# EAGLE board 15R (EAGLE 9.6.0), part 1 of 2
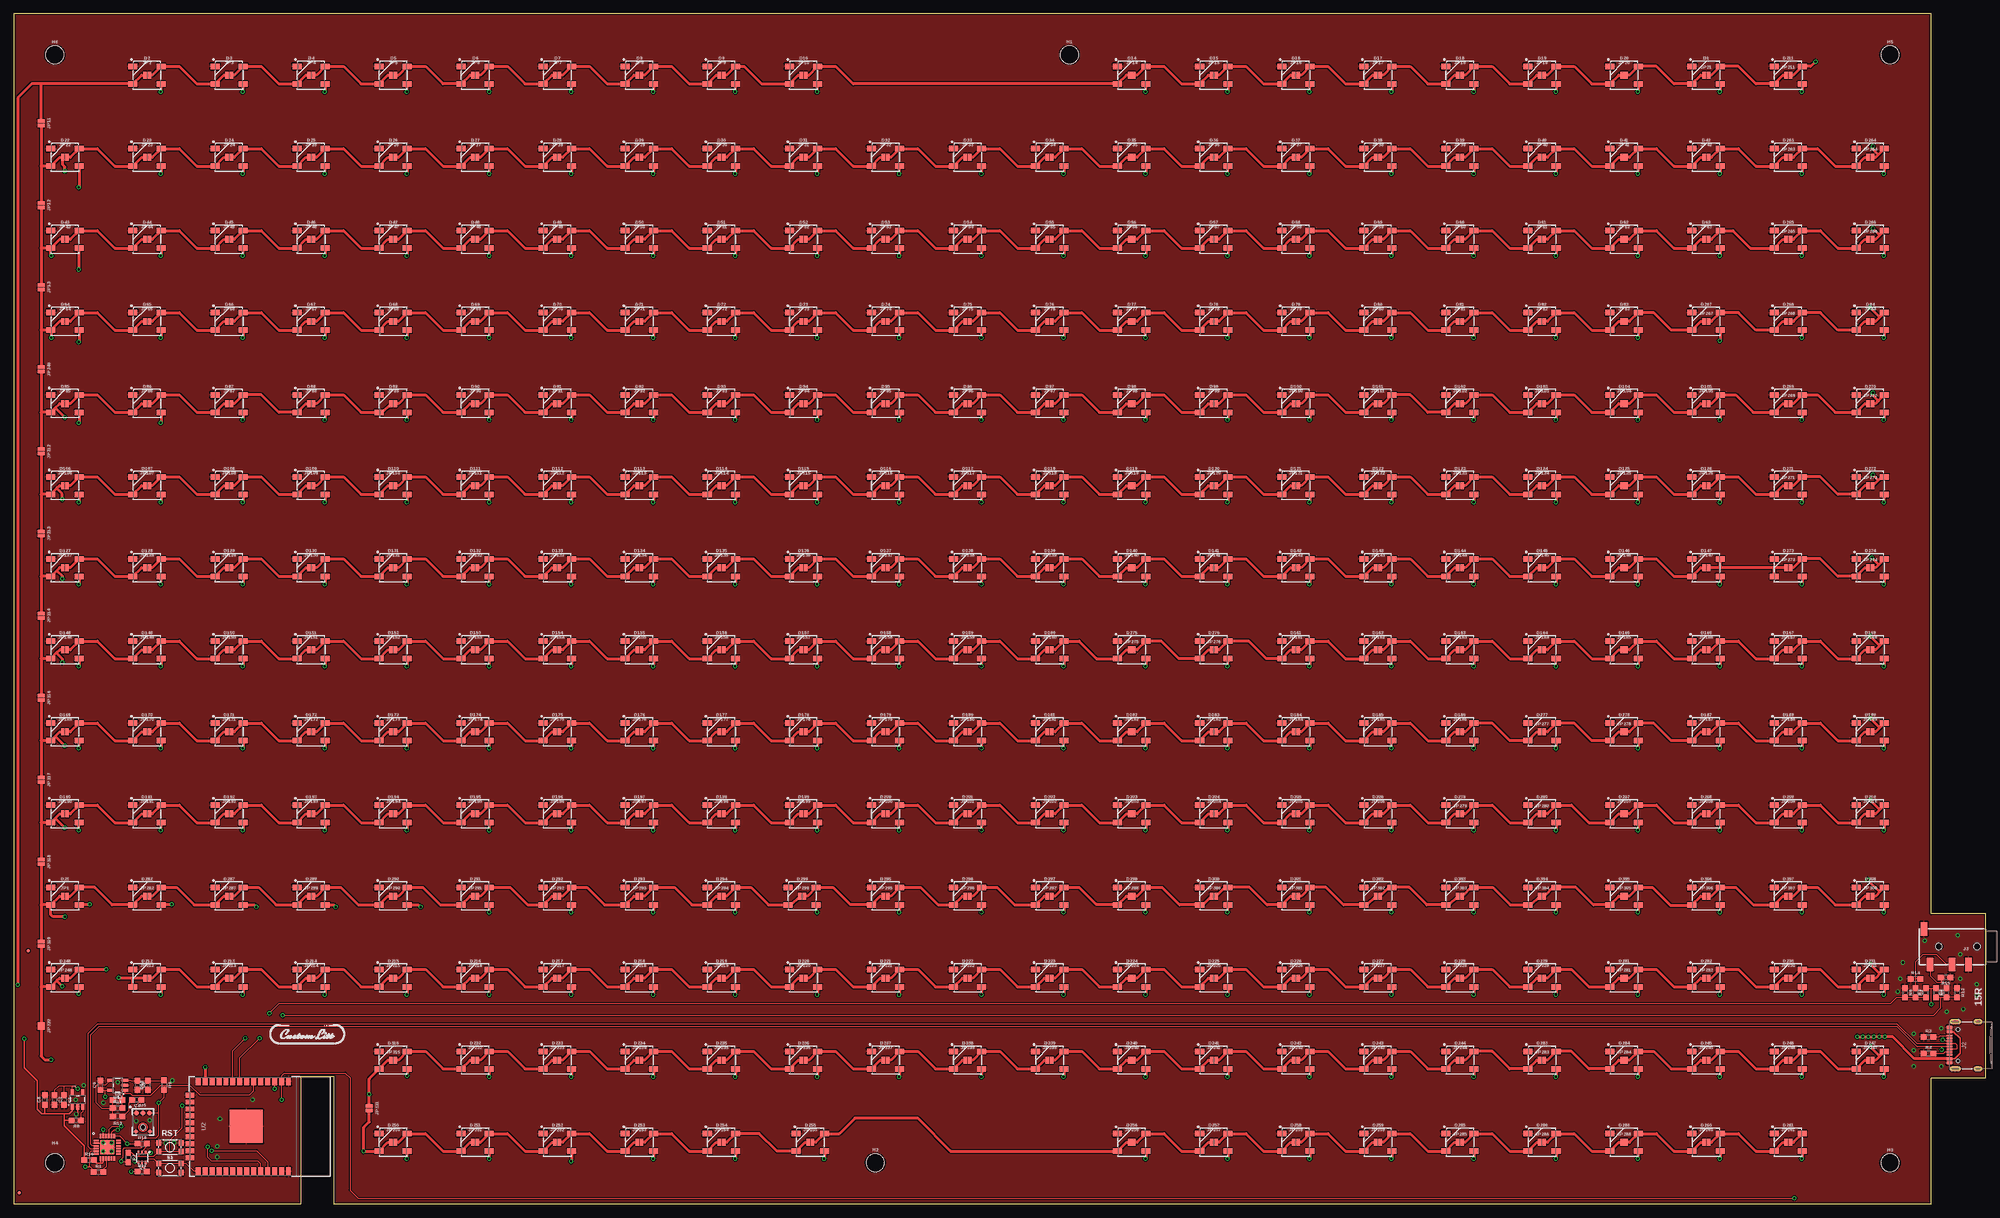
[diagram p7: board, top side]
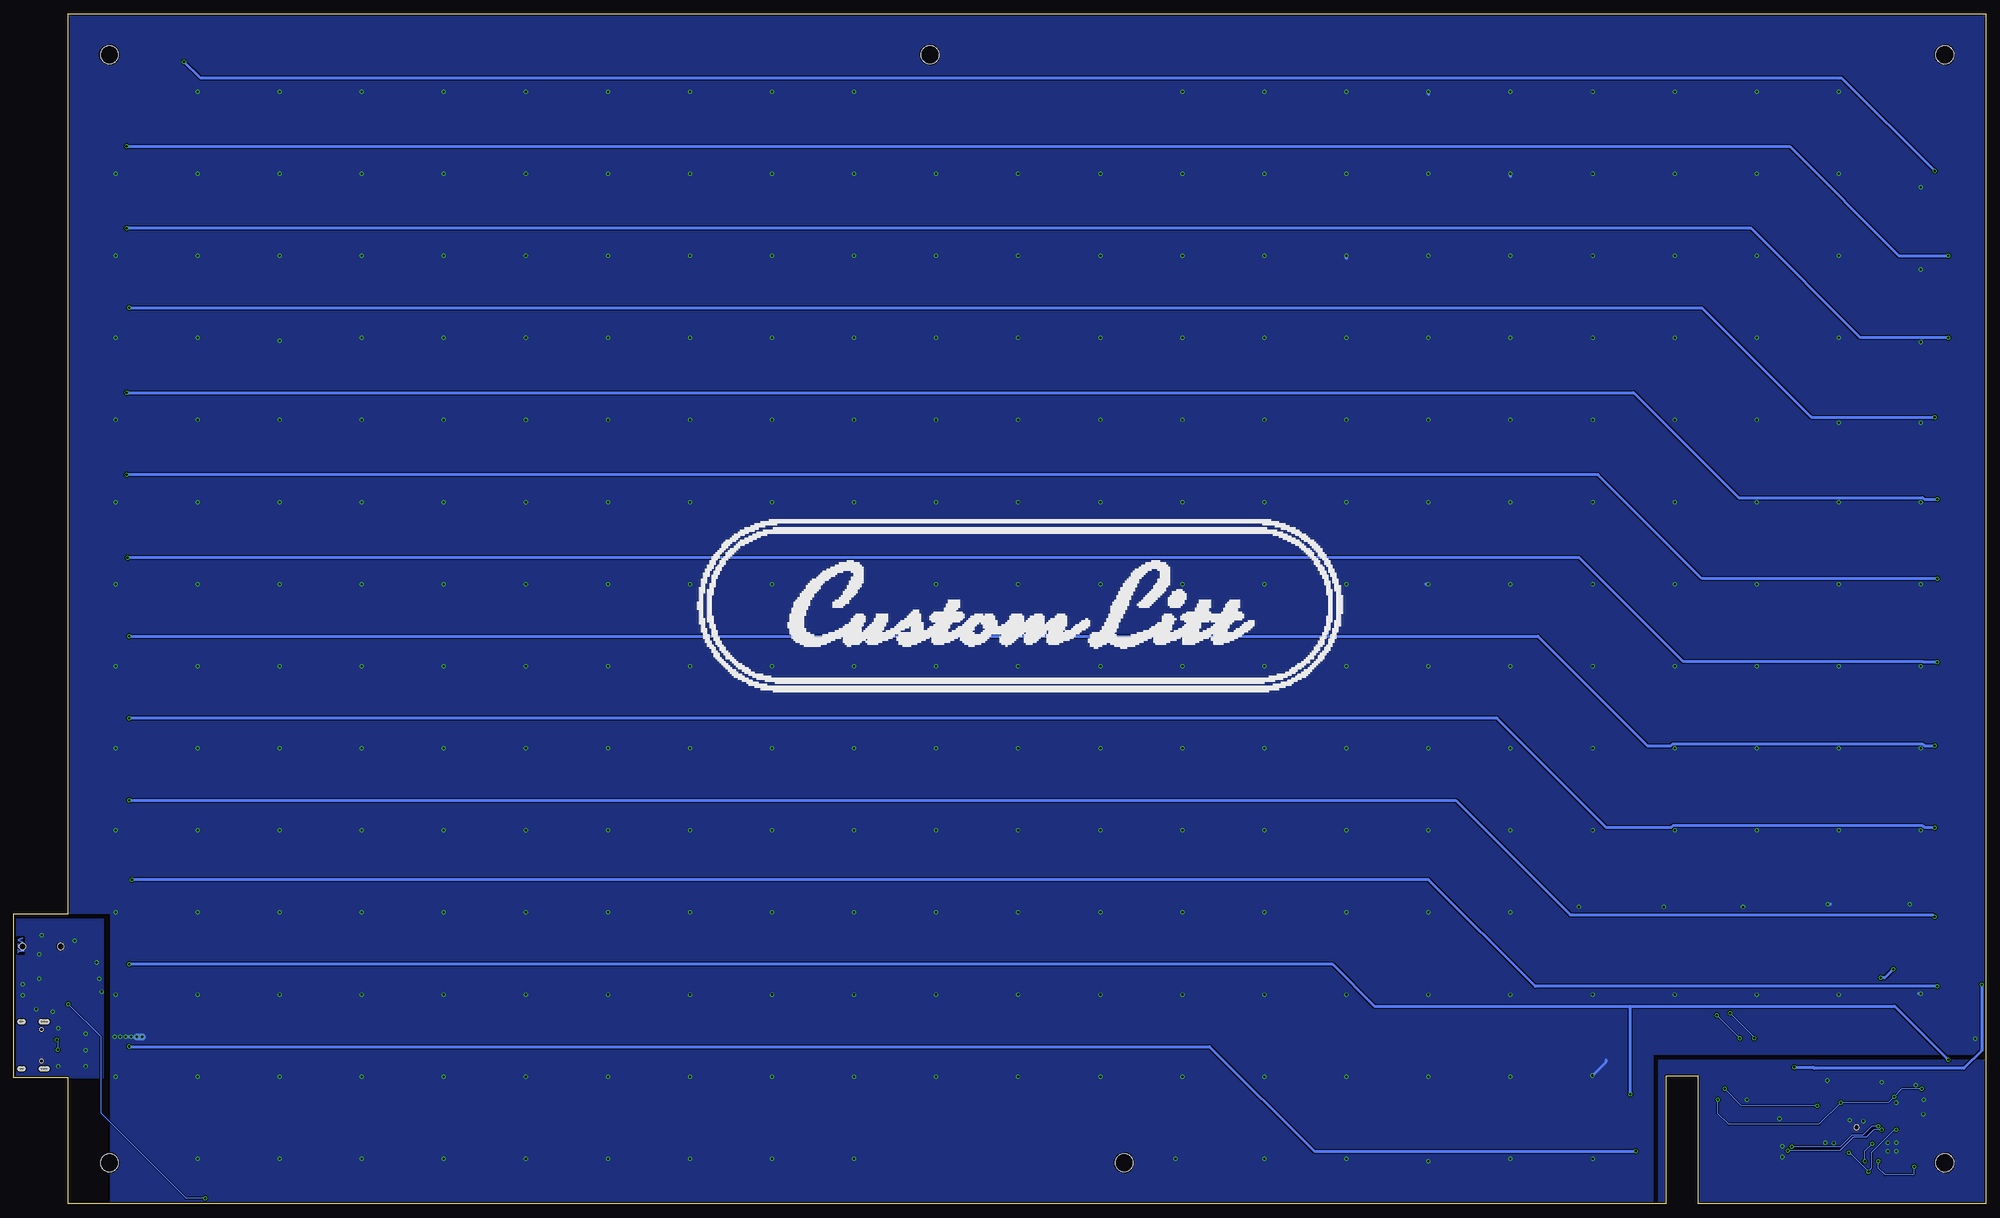
[diagram p8: board, bottom side, seen from below]

Size 360.5 x 217.5 mm. Coordinates in mm from the lower left corner, seen from the top.
Outline: 350.5,0 350.5,23 360.5,23 360.5,53 350.5,53 350.5,217.5 0,217.5 0,0 52.56,0 52.56,23.32 58.53,23.32 58.53,0 350.5,0
Copper layers (1*16): Top 0.035mm / dielectric 1.5mm / Bottom 0.035mm
Design rules "SparkFun-2-layer-TIGHT *": minimum track width 7mil, minimum drill 15mil, track to track 7mil, track to pad 7mil, pad to pad 7mil, via to via 7mil, smd to smd 7mil, copper to edge 7mil, drill to drill 7mil, minimum pad ring 7mil, minimum via ring 7mil, stop-mask expansion 4mil, vias tented up to drill 25mil, thermal gap 10mil

## Footprints (pad centres in the part's own frame; a part is rotated, then mirrored left to right if it is on the bottom)
0603 = smd 1.1 x 1: 1 -0.85,0; 2 0.85,0
WS2812B = smd 1.651 x 1: 1 2.577,-1.6; 2 2.577,1.6; 3 -2.577,1.6; 4 -2.577,-1.6
FIDUCIAL-MICRO = smd 0.635 x 0.635: 1 0,0
STAND-OFF = hole 3.302: 0,0
USB-C-16P = smd 0.3 x 1.016: A5 -1.25,0.154; A6 -0.25,0.154; A7 0.25,0.154; A8 1.25,0.154; B5 1.75,0.154; B6 0.75,0.154; B7 -0.75,0.154; B8 -1.75,0.154 | smd 0.6 x 1.016: GND -3.225,0.154; GND2 3.225,0.154 | smd 1 x 2.1: SHLD1 -4.32,-0.915; SHLD2 4.32,-0.915 | smd 1 x 2.1 bottom: SHLD3 -4.32,-0.915; SHLD4 4.32,-0.915 | smd 1 x 1.6: SHLD5 -4.32,-5.095; SHLD8 4.32,-5.095 | smd 1 x 1.6 bottom: SHLD6 -4.32,-5.095; SHLD7 4.32,-5.095 | smd 0.55 x 1.016: VBUS1 -2.45,0.154; VBUS2 2.45,0.154 | hole 0.65: -2.89,-1.445; 2.89,-1.445
AUDIO_JACK_3.5MM_TRRS_SMD_RA = smd 1.2 x 2.5: EARTH 11.3,-3.25; RING1 6.2,3.25; RING2 3.2,3.25; TIP 10.2,3.25 | hole 1.2: 1.6,0; 8.6,0
SMT-JUMPER_2_NO_NO-SILK = smd 0.635 x 1.27: 1 -0.406,0; 2 0.406,0
SC70-6 = smd 0.3 x 0.66: 1 -0.65,-0.92; 2 0,-0.92; 3 0.65,-0.92; 4 0.65,0.92; 5 0,0.92; 6 -0.65,0.92
TACTILE_SWITCH_SMD_4.6X2.8MM = smd 0.9 x 1: 1 -2.05,-0.8; 2 2.05,-0.8; 3 2.05,0.8; 4 -2.05,0.8
ESP-WROOM-32-NARROW = smd 0.9 x 1.5: 1 6.43,8.238; 2 5.16,8.238; 3 3.89,8.238; 4 2.62,8.238; 5 1.35,8.238; 6 0.08,8.238; 7 -1.19,8.238; 8 -2.46,8.238; 9 -3.73,8.238; 10 -5,8.238; 11 -6.27,8.238; 12 -7.54,8.238; 13 -8.81,8.238; 14 -10.08,8.238; 25 -10.08,-8.238; 26 -8.81,-8.238; 27 -7.54,-8.238; 28 -6.27,-8.238; 29 -5,-8.238; 30 -3.73,-8.238; 31 -2.46,-8.238; 32 -1.19,-8.238; 33 0.08,-8.238; 34 1.35,-8.238; 35 2.62,-8.238; 36 3.89,-8.238; 37 5.16,-8.238; 38 6.43,-8.238 | smd 1.5 x 0.9: 15 -11.57,5.715; 16 -11.57,4.445; 17 -11.57,3.175; 18 -11.57,1.905; 19 -11.57,0.635; 20 -11.57,-0.635; 21 -11.57,-1.905; 22 -11.57,-3.175; 23 -11.57,-4.445; 24 -11.57,-5.715 | smd 6 x 6: GND -1.27,0
SOT23-5 = smd 0.55 x 1.2: 1 -0.95,-1.3; 2 0,-1.3; 3 0.95,-1.3; 4 0.95,1.3; 5 -0.95,1.3
QFN24 = smd 0.85 x 0.3: 1 -2.05,1.25; 2 -2.05,0.75; 3 -2.05,0.25; 4 -2.05,-0.25; 5 -2.05,-0.75; 6 -2.05,-1.25; 13 2.05,-1.25; 14 2.05,-0.75; 15 2.05,-0.25; 16 2.05,0.25; 17 2.05,0.75; 18 2.05,1.25 | smd 0.3 x 0.85: 7 -1.25,-2.05; 8 -0.75,-2.05; 9 -0.25,-2.05; 10 0.25,-2.05; 11 0.75,-2.05; 12 1.25,-2.05; 19 1.25,2.05; 20 0.75,2.05; 21 0.25,2.05; 22 -0.25,2.05; 23 -0.75,2.05; 24 -1.25,2.05 | smd 2.55 x 2.55: PAD 0,0
ADMP401 = smd 0.9 x 0.9: 1 -1.2,2.62; 5 1.2,2.62; 6 0,2.62 | smd 0.7 x 0.7: 2 1.3,-0.8; 4 -1.3,-0.8 | hole 0.9: 0,0

## Placement (x,y rotation side)
C1  10uF  [0603]  9.2,19 270 top
C2  0.1uF  [0603]  347.62,38.59 270 top
C3  0.1uF  [0603]  353.34,38.59 90 top
C4  4.7uF  [0603]  22.5,19 180 top
C5  100pF  [0603]  19,19 0 top
C6  1.0uF  [0603]  22.61,21.67 270 top
C7  1.0uF  [0603]  7.45,19 270 top
C8  1.0uF  [0603]  5.7,19 90 top
C9  0.1uF  [0603]  15.86,21.67 90 top
D1  WS2812B  [WS2812B]  309.38,206.25 0 top
D2  WS2812B  [WS2812B]  24.38,206.25 0 top
D3  WS2812B  [WS2812B]  39.38,206.25 0 top
D4  WS2812B  [WS2812B]  54.38,206.25 0 top
D5  WS2812B  [WS2812B]  69.38,206.25 0 top
D6  WS2812B  [WS2812B]  84.38,206.25 0 top
D7  WS2812B  [WS2812B]  99.38,206.25 0 top
D8  WS2812B  [WS2812B]  114.38,206.25 0 top
D9  WS2812B  [WS2812B]  129.38,206.25 0 top
D10  WS2812B  [WS2812B]  144.38,206.25 0 top
D14  WS2812B  [WS2812B]  204.38,206.25 0 top
D15  WS2812B  [WS2812B]  219.38,206.25 0 top
D16  WS2812B  [WS2812B]  234.38,206.25 0 top
D17  WS2812B  [WS2812B]  249.38,206.25 0 top
D18  WS2812B  [WS2812B]  264.38,206.25 0 top
D19  WS2812B  [WS2812B]  279.38,206.25 0 top
D20  WS2812B  [WS2812B]  294.38,206.25 0 top
D21  WS2812B  [WS2812B]  9.38,56.25 0 top
D22  WS2812B  [WS2812B]  9.38,191.25 0 top
D23  WS2812B  [WS2812B]  24.38,191.25 0 top
D24  WS2812B  [WS2812B]  39.38,191.25 0 top
D25  WS2812B  [WS2812B]  54.38,191.25 0 top
D26  WS2812B  [WS2812B]  69.38,191.25 0 top
D27  WS2812B  [WS2812B]  84.38,191.25 0 top
D28  WS2812B  [WS2812B]  99.38,191.25 0 top
D29  WS2812B  [WS2812B]  114.38,191.25 0 top
D30  WS2812B  [WS2812B]  129.38,191.25 0 top
D31  WS2812B  [WS2812B]  144.38,191.25 0 top
D32  WS2812B  [WS2812B]  159.38,191.25 0 top
D33  WS2812B  [WS2812B]  174.38,191.25 0 top
D34  WS2812B  [WS2812B]  189.38,191.25 0 top
D35  WS2812B  [WS2812B]  204.38,191.25 0 top
D36  WS2812B  [WS2812B]  219.38,191.25 0 top
D37  WS2812B  [WS2812B]  234.38,191.25 0 top
D38  WS2812B  [WS2812B]  249.38,191.25 0 top
D39  WS2812B  [WS2812B]  264.38,191.25 0 top
D40  WS2812B  [WS2812B]  279.38,191.25 0 top
D41  WS2812B  [WS2812B]  294.38,191.25 0 top
D42  WS2812B  [WS2812B]  309.38,191.25 0 top
D43  WS2812B  [WS2812B]  9.38,176.25 0 top
D44  WS2812B  [WS2812B]  24.38,176.25 0 top
D45  WS2812B  [WS2812B]  39.38,176.25 0 top
D46  WS2812B  [WS2812B]  54.38,176.25 0 top
D47  WS2812B  [WS2812B]  69.38,176.25 0 top
D48  WS2812B  [WS2812B]  84.38,176.25 0 top
D49  WS2812B  [WS2812B]  99.38,176.25 0 top
D50  WS2812B  [WS2812B]  114.38,176.25 0 top
D51  WS2812B  [WS2812B]  129.38,176.25 0 top
D52  WS2812B  [WS2812B]  144.38,176.25 0 top
D53  WS2812B  [WS2812B]  159.38,176.25 0 top
D54  WS2812B  [WS2812B]  174.38,176.25 0 top
D55  WS2812B  [WS2812B]  189.38,176.25 0 top
D56  WS2812B  [WS2812B]  204.38,176.25 0 top
D57  WS2812B  [WS2812B]  219.38,176.25 0 top
D58  WS2812B  [WS2812B]  234.38,176.25 0 top
D59  WS2812B  [WS2812B]  249.38,176.25 0 top
D60  WS2812B  [WS2812B]  264.38,176.25 0 top
D61  WS2812B  [WS2812B]  279.38,176.25 0 top
D62  WS2812B  [WS2812B]  294.38,176.25 0 top
D63  WS2812B  [WS2812B]  309.38,176.25 0 top
D64  WS2812B  [WS2812B]  9.38,161.25 0 top
D65  WS2812B  [WS2812B]  24.38,161.25 0 top
D66  WS2812B  [WS2812B]  39.38,161.25 0 top
D67  WS2812B  [WS2812B]  54.38,161.25 0 top
D68  WS2812B  [WS2812B]  69.38,161.25 0 top
D69  WS2812B  [WS2812B]  84.38,161.25 0 top
D70  WS2812B  [WS2812B]  99.38,161.25 0 top
D71  WS2812B  [WS2812B]  114.38,161.25 0 top
D72  WS2812B  [WS2812B]  129.38,161.25 0 top
D73  WS2812B  [WS2812B]  144.38,161.25 0 top
D74  WS2812B  [WS2812B]  159.38,161.25 0 top
D75  WS2812B  [WS2812B]  174.38,161.25 0 top
D76  WS2812B  [WS2812B]  189.38,161.25 0 top
D77  WS2812B  [WS2812B]  204.38,161.25 0 top
D78  WS2812B  [WS2812B]  219.38,161.25 0 top
D79  WS2812B  [WS2812B]  234.38,161.25 0 top
D80  WS2812B  [WS2812B]  249.38,161.25 0 top
D81  WS2812B  [WS2812B]  264.38,161.25 0 top
D82  WS2812B  [WS2812B]  279.38,161.25 0 top
D83  WS2812B  [WS2812B]  294.38,161.25 0 top
D84  WS2812B  [WS2812B]  339.38,161.25 0 top
D85  WS2812B  [WS2812B]  9.38,146.25 0 top
D86  WS2812B  [WS2812B]  24.38,146.25 0 top
D87  WS2812B  [WS2812B]  39.38,146.25 0 top
D88  WS2812B  [WS2812B]  54.38,146.25 0 top
D89  WS2812B  [WS2812B]  69.38,146.25 0 top
D90  WS2812B  [WS2812B]  84.38,146.25 0 top
D91  WS2812B  [WS2812B]  99.38,146.25 0 top
D92  WS2812B  [WS2812B]  114.38,146.25 0 top
D93  WS2812B  [WS2812B]  129.38,146.25 0 top
D94  WS2812B  [WS2812B]  144.38,146.25 0 top
D95  WS2812B  [WS2812B]  159.38,146.25 0 top
D96  WS2812B  [WS2812B]  174.38,146.25 0 top
D97  WS2812B  [WS2812B]  189.38,146.25 0 top
D98  WS2812B  [WS2812B]  204.38,146.25 0 top
D99  WS2812B  [WS2812B]  219.38,146.25 0 top
D100  WS2812B  [WS2812B]  234.38,146.25 0 top
D101  WS2812B  [WS2812B]  249.38,146.25 0 top
D102  WS2812B  [WS2812B]  264.38,146.25 0 top
D103  WS2812B  [WS2812B]  279.38,146.25 0 top
D104  WS2812B  [WS2812B]  294.38,146.25 0 top
D105  WS2812B  [WS2812B]  309.38,146.25 0 top
D106  WS2812B  [WS2812B]  9.38,131.25 0 top
D107  WS2812B  [WS2812B]  24.38,131.25 0 top
D108  WS2812B  [WS2812B]  39.38,131.25 0 top
D109  WS2812B  [WS2812B]  54.38,131.25 0 top
D110  WS2812B  [WS2812B]  69.38,131.25 0 top
D111  WS2812B  [WS2812B]  84.38,131.25 0 top
D112  WS2812B  [WS2812B]  99.38,131.25 0 top
D113  WS2812B  [WS2812B]  114.38,131.25 0 top
D114  WS2812B  [WS2812B]  129.38,131.25 0 top
D115  WS2812B  [WS2812B]  144.38,131.25 0 top
D116  WS2812B  [WS2812B]  159.38,131.25 0 top
D117  WS2812B  [WS2812B]  174.38,131.25 0 top
D118  WS2812B  [WS2812B]  189.38,131.25 0 top
D119  WS2812B  [WS2812B]  204.38,131.25 0 top
D120  WS2812B  [WS2812B]  219.38,131.25 0 top
D121  WS2812B  [WS2812B]  234.38,131.25 0 top
D122  WS2812B  [WS2812B]  249.38,131.25 0 top
D123  WS2812B  [WS2812B]  264.38,131.25 0 top
D124  WS2812B  [WS2812B]  279.38,131.25 0 top
D125  WS2812B  [WS2812B]  294.38,131.25 0 top
D126  WS2812B  [WS2812B]  309.38,131.25 0 top
D127  WS2812B  [WS2812B]  9.38,116.25 0 top
D128  WS2812B  [WS2812B]  24.38,116.25 0 top
D129  WS2812B  [WS2812B]  39.38,116.25 0 top
D130  WS2812B  [WS2812B]  54.38,116.25 0 top
D131  WS2812B  [WS2812B]  69.38,116.25 0 top
D132  WS2812B  [WS2812B]  84.38,116.25 0 top
D133  WS2812B  [WS2812B]  99.38,116.25 0 top
D134  WS2812B  [WS2812B]  114.38,116.25 0 top
D135  WS2812B  [WS2812B]  129.38,116.25 0 top
D136  WS2812B  [WS2812B]  144.38,116.25 0 top
D137  WS2812B  [WS2812B]  159.38,116.25 0 top
D138  WS2812B  [WS2812B]  174.38,116.25 0 top
D139  WS2812B  [WS2812B]  189.38,116.25 0 top
D140  WS2812B  [WS2812B]  204.38,116.25 0 top
D141  WS2812B  [WS2812B]  219.38,116.25 0 top
D142  WS2812B  [WS2812B]  234.38,116.25 0 top
D143  WS2812B  [WS2812B]  249.38,116.25 0 top
D144  WS2812B  [WS2812B]  264.38,116.25 0 top
D145  WS2812B  [WS2812B]  279.38,116.25 0 top
D146  WS2812B  [WS2812B]  294.38,116.25 0 top
D147  WS2812B  [WS2812B]  309.38,116.25 0 top
D148  WS2812B  [WS2812B]  9.38,101.25 0 top
D149  WS2812B  [WS2812B]  24.38,101.25 0 top
D150  WS2812B  [WS2812B]  39.38,101.25 0 top
D151  WS2812B  [WS2812B]  54.38,101.25 0 top
D152  WS2812B  [WS2812B]  69.38,101.25 0 top
D153  WS2812B  [WS2812B]  84.38,101.25 0 top
D154  WS2812B  [WS2812B]  99.38,101.25 0 top
D155  WS2812B  [WS2812B]  114.38,101.25 0 top
D156  WS2812B  [WS2812B]  129.38,101.25 0 top
D157  WS2812B  [WS2812B]  144.38,101.25 0 top
D158  WS2812B  [WS2812B]  159.38,101.25 0 top
D159  WS2812B  [WS2812B]  174.38,101.25 0 top
D160  WS2812B  [WS2812B]  189.38,101.25 0 top
D161  WS2812B  [WS2812B]  234.38,101.25 0 top
D162  WS2812B  [WS2812B]  249.38,101.25 0 top
D163  WS2812B  [WS2812B]  264.38,101.25 0 top
D164  WS2812B  [WS2812B]  279.38,101.25 0 top
D165  WS2812B  [WS2812B]  294.38,101.25 0 top
D166  WS2812B  [WS2812B]  309.38,101.25 0 top
D167  WS2812B  [WS2812B]  324.38,101.25 0 top
D168  WS2812B  [WS2812B]  339.38,101.25 0 top
D169  WS2812B  [WS2812B]  9.38,86.25 0 top
D170  WS2812B  [WS2812B]  24.38,86.25 0 top
D171  WS2812B  [WS2812B]  39.38,86.25 0 top
D172  WS2812B  [WS2812B]  54.38,86.25 0 top
D173  WS2812B  [WS2812B]  69.38,86.25 0 top
D174  WS2812B  [WS2812B]  84.38,86.25 0 top
D175  WS2812B  [WS2812B]  99.38,86.25 0 top
D176  WS2812B  [WS2812B]  114.38,86.25 0 top
D177  WS2812B  [WS2812B]  129.38,86.25 0 top
D178  WS2812B  [WS2812B]  144.38,86.25 0 top
D179  WS2812B  [WS2812B]  159.38,86.25 0 top
D180  WS2812B  [WS2812B]  174.38,86.25 0 top
D181  WS2812B  [WS2812B]  189.38,86.25 0 top
D182  WS2812B  [WS2812B]  204.38,86.25 0 top
D183  WS2812B  [WS2812B]  219.38,86.25 0 top
D184  WS2812B  [WS2812B]  234.38,86.25 0 top
D185  WS2812B  [WS2812B]  249.38,86.25 0 top
D186  WS2812B  [WS2812B]  264.38,86.25 0 top
D187  WS2812B  [WS2812B]  309.38,86.25 0 top
D188  WS2812B  [WS2812B]  324.38,86.25 0 top
D189  WS2812B  [WS2812B]  339.38,86.25 0 top
D190  WS2812B  [WS2812B]  9.38,71.25 0 top
D191  WS2812B  [WS2812B]  24.38,71.25 0 top
D192  WS2812B  [WS2812B]  39.38,71.25 0 top
D193  WS2812B  [WS2812B]  54.38,71.25 0 top
D194  WS2812B  [WS2812B]  69.38,71.25 0 top
D195  WS2812B  [WS2812B]  84.38,71.25 0 top
D196  WS2812B  [WS2812B]  99.38,71.25 0 top
D197  WS2812B  [WS2812B]  114.38,71.25 0 top
D198  WS2812B  [WS2812B]  129.38,71.25 0 top
D199  WS2812B  [WS2812B]  144.38,71.25 0 top
D200  WS2812B  [WS2812B]  159.38,71.25 0 top
D201  WS2812B  [WS2812B]  174.38,71.25 0 top
D202  WS2812B  [WS2812B]  189.38,71.25 0 top
D203  WS2812B  [WS2812B]  204.38,71.25 0 top
D204  WS2812B  [WS2812B]  219.38,71.25 0 top
D205  WS2812B  [WS2812B]  234.38,71.25 0 top
D206  WS2812B  [WS2812B]  249.38,71.25 0 top
D207  WS2812B  [WS2812B]  294.38,71.25 0 top
D208  WS2812B  [WS2812B]  309.38,71.25 0 top
D209  WS2812B  [WS2812B]  324.38,71.25 0 top
D210  WS2812B  [WS2812B]  339.38,71.25 0 top
D211  WS2812B  [WS2812B]  324.38,206.25 0 top
D212  WS2812B  [WS2812B]  24.38,41.25 0 top
D213  WS2812B  [WS2812B]  39.38,41.25 0 top
D214  WS2812B  [WS2812B]  54.38,41.25 0 top
D215  WS2812B  [WS2812B]  69.38,41.25 0 top
D216  WS2812B  [WS2812B]  84.38,41.25 0 top
D217  WS2812B  [WS2812B]  99.38,41.25 0 top
D218  WS2812B  [WS2812B]  114.38,41.25 0 top
D219  WS2812B  [WS2812B]  129.38,41.25 0 top
D220  WS2812B  [WS2812B]  144.38,41.25 0 top
D221  WS2812B  [WS2812B]  159.38,41.25 0 top
D222  WS2812B  [WS2812B]  174.38,41.25 0 top
D223  WS2812B  [WS2812B]  189.38,41.25 0 top
D224  WS2812B  [WS2812B]  204.38,41.25 0 top
D225  WS2812B  [WS2812B]  219.38,41.25 0 top
D226  WS2812B  [WS2812B]  234.38,41.25 0 top
D227  WS2812B  [WS2812B]  249.38,41.25 0 top
D228  WS2812B  [WS2812B]  264.38,41.25 0 top
D229  WS2812B  [WS2812B]  279.38,41.25 0 top
D230  WS2812B  [WS2812B]  324.38,41.25 0 top
D231  WS2812B  [WS2812B]  339.38,41.25 0 top
D232  WS2812B  [WS2812B]  84.38,26.25 0 top
D233  WS2812B  [WS2812B]  99.38,26.25 0 top
D234  WS2812B  [WS2812B]  114.38,26.25 0 top
D235  WS2812B  [WS2812B]  129.38,26.25 0 top
D236  WS2812B  [WS2812B]  144.38,26.25 0 top
D237  WS2812B  [WS2812B]  159.38,26.25 0 top
D238  WS2812B  [WS2812B]  174.38,26.25 0 top
D239  WS2812B  [WS2812B]  189.38,26.25 0 top
D240  WS2812B  [WS2812B]  204.38,26.25 0 top
D241  WS2812B  [WS2812B]  219.38,26.25 0 top
D242  WS2812B  [WS2812B]  234.38,26.25 0 top
D243  WS2812B  [WS2812B]  249.38,26.25 0 top
D244  WS2812B  [WS2812B]  264.38,26.25 0 top
D245  WS2812B  [WS2812B]  309.38,26.25 0 top
D246  WS2812B  [WS2812B]  324.38,26.25 0 top
D247  WS2812B  [WS2812B]  339.38,26.25 0 top
D248  WS2812B  [WS2812B]  9.38,41.25 0 top
D250  WS2812B  [WS2812B]  69.38,11.25 0 top
D251  WS2812B  [WS2812B]  84.38,11.25 0 top
D252  WS2812B  [WS2812B]  99.38,11.25 0 top
D253  WS2812B  [WS2812B]  114.38,11.25 0 top
D254  WS2812B  [WS2812B]  129.38,11.25 0 top
D255  WS2812B  [WS2812B]  145.62,11.25 0 top
D256  WS2812B  [WS2812B]  204.38,11.25 0 top
D257  WS2812B  [WS2812B]  219.38,11.25 0 top
D258  WS2812B  [WS2812B]  234.38,11.25 0 top
D259  WS2812B  [WS2812B]  249.38,11.25 0 top
D260  WS2812B  [WS2812B]  309.38,11.25 0 top
D261  WS2812B  [WS2812B]  324.38,11.25 0 top
D262  WS2812B  [WS2812B]  24.38,56.25 0 top
D263  WS2812B  [WS2812B]  324.38,191.25 0 top
D264  WS2812B  [WS2812B]  339.38,191.25 0 top
D265  WS2812B  [WS2812B]  324.38,176.25 0 top
D266  WS2812B  [WS2812B]  339.38,176.25 0 top
D267  WS2812B  [WS2812B]  309.38,161.25 0 top
D268  WS2812B  [WS2812B]  324.38,161.25 0 top
D269  WS2812B  [WS2812B]  324.38,146.25 0 top
D270  WS2812B  [WS2812B]  339.38,146.25 0 top
D271  WS2812B  [WS2812B]  324.38,131.25 0 top
D272  WS2812B  [WS2812B]  339.38,131.25 0 top
D273  WS2812B  [WS2812B]  324.38,116.25 0 top
D274  WS2812B  [WS2812B]  339.38,116.25 0 top
D275  WS2812B  [WS2812B]  204.38,101.25 0 top
D276  WS2812B  [WS2812B]  219.38,101.25 0 top
D277  WS2812B  [WS2812B]  279.38,86.25 0 top
D278  WS2812B  [WS2812B]  294.38,86.25 0 top
D279  WS2812B  [WS2812B]  264.38,71.25 0 top
D280  WS2812B  [WS2812B]  279.38,71.25 0 top
D281  WS2812B  [WS2812B]  294.38,41.25 0 top
D282  WS2812B  [WS2812B]  309.38,41.25 0 top
D283  WS2812B  [WS2812B]  279.38,26.25 0 top
D284  WS2812B  [WS2812B]  294.38,26.25 0 top
D285  WS2812B  [WS2812B]  264.38,11.25 0 top
D286  WS2812B  [WS2812B]  279.38,11.25 0 top
D287  WS2812B  [WS2812B]  39.38,56.25 0 top
D288  WS2812B  [WS2812B]  294.38,11.25 0 top
D289  WS2812B  [WS2812B]  54.38,56.25 0 top
D290  WS2812B  [WS2812B]  69.38,56.25 0 top
D291  WS2812B  [WS2812B]  84.38,56.25 0 top
D292  WS2812B  [WS2812B]  99.38,56.25 0 top
D293  WS2812B  [WS2812B]  114.38,56.25 0 top
D294  WS2812B  [WS2812B]  129.38,56.25 0 top
D295  WS2812B  [WS2812B]  159.38,56.25 0 top
D296  WS2812B  [WS2812B]  174.38,56.25 0 top
D297  WS2812B  [WS2812B]  189.38,56.25 0 top
D298  WS2812B  [WS2812B]  204.38,56.25 0 top
D299  WS2812B  [WS2812B]  144.13,56.25 0 top
D300  WS2812B  [WS2812B]  219.38,56.25 0 top
D301  WS2812B  [WS2812B]  234.38,56.25 0 top
D302  WS2812B  [WS2812B]  249.38,56.25 0 top
D303  WS2812B  [WS2812B]  264.38,56.25 0 top
D304  WS2812B  [WS2812B]  279.38,56.25 0 top
D305  WS2812B  [WS2812B]  294.38,56.25 0 top
D306  WS2812B  [WS2812B]  309.38,56.25 0 top
D307  WS2812B  [WS2812B]  324.38,56.25 0 top
D308  WS2812B  [WS2812B]  339.38,56.25 0 top
D315  WS2812B  [WS2812B]  69.38,26.25 0 top
FD2  FIDUCIALUFIDUCIAL  [FIDUCIAL-MICRO]  2.62,46.25 0 top
FD4  FIDUCIALUFIDUCIAL  [FIDUCIAL-MICRO]  1,2 0 top
H1  STAND-OFF  [STAND-OFF]  193,210 0 top
H2  STAND-OFF  [STAND-OFF]  157.5,7.5 0 top
H3  STAND-OFF  [STAND-OFF]  343,7.5 0 top
H4  STAND-OFF  [STAND-OFF]  7.5,7.5 0 top
H5  STAND-OFF  [STAND-OFF]  343,210 0 top
H6  STAND-OFF  [STAND-OFF]  7.5,210 0 top
J2  USB Female Type C Connector  [USB-C-16P]  354,29 90 top
J3  AUDIO_JACK_TRRSSMD_RA  [AUDIO_JACK_3.5MM_TRRS_SMD_RA]  360.5,47 180 top
JP1  JUMPER-SMT_2_NO_NO-SILK  [SMT-JUMPER_2_NO_NO-SILK]  9.38,56.25 0 top
JP2  JUMPER-SMT_2_NO_NO-SILK  [SMT-JUMPER_2_NO_NO-SILK]  24.38,206.25 0 top
JP3  JUMPER-SMT_2_NO_NO-SILK  [SMT-JUMPER_2_NO_NO-SILK]  39.38,206.25 0 top
JP4  JUMPER-SMT_2_NO_NO-SILK  [SMT-JUMPER_2_NO_NO-SILK]  54.38,206.25 0 top
JP5  JUMPER-SMT_2_NO_NO-SILK  [SMT-JUMPER_2_NO_NO-SILK]  69.38,206.25 0 top
JP6  JUMPER-SMT_2_NO_NO-SILK  [SMT-JUMPER_2_NO_NO-SILK]  84.38,206.25 0 top
JP7  JUMPER-SMT_2_NO_NO-SILK  [SMT-JUMPER_2_NO_NO-SILK]  99.38,206.25 0 top
JP8  JUMPER-SMT_2_NO_NO-SILK  [SMT-JUMPER_2_NO_NO-SILK]  114.38,206.25 0 top
JP9  JUMPER-SMT_2_NO_NO-SILK  [SMT-JUMPER_2_NO_NO-SILK]  129.38,206.25 0 top
JP10  JUMPER-SMT_2_NO_NO-SILK  [SMT-JUMPER_2_NO_NO-SILK]  144.38,206.25 0 top
JP11  JUMPER-SMT_2_NO_NO-SILK  [SMT-JUMPER_2_NO_NO-SILK]  5,197.5 270 top
JP12  JUMPER-SMT_2_NO_NO-SILK  [SMT-JUMPER_2_NO_NO-SILK]  5,182.5 270 top
JP13  JUMPER-SMT_2_NO_NO-SILK  [SMT-JUMPER_2_NO_NO-SILK]  5,167.5 270 top
JP14  JUMPER-SMT_2_NO_NO-SILK  [SMT-JUMPER_2_NO_NO-SILK]  204.38,206.25 0 top
JP15  JUMPER-SMT_2_NO_NO-SILK  [SMT-JUMPER_2_NO_NO-SILK]  219.38,206.25 0 top
JP16  JUMPER-SMT_2_NO_NO-SILK  [SMT-JUMPER_2_NO_NO-SILK]  234.38,206.25 0 top
JP17  JUMPER-SMT_2_NO_NO-SILK  [SMT-JUMPER_2_NO_NO-SILK]  249.38,206.25 0 top
JP18  JUMPER-SMT_2_NO_NO-SILK  [SMT-JUMPER_2_NO_NO-SILK]  264.38,206.25 0 top
JP19  JUMPER-SMT_2_NO_NO-SILK  [SMT-JUMPER_2_NO_NO-SILK]  279.38,206.25 0 top
JP20  JUMPER-SMT_2_NO_NO-SILK  [SMT-JUMPER_2_NO_NO-SILK]  294.38,206.25 0 top
JP21  JUMPER-SMT_2_NO_NO-SILK  [SMT-JUMPER_2_NO_NO-SILK]  309.38,206.25 0 top
JP22  JUMPER-SMT_2_NO_NO-SILK  [SMT-JUMPER_2_NO_NO-SILK]  9.38,191.25 0 top
JP23  JUMPER-SMT_2_NO_NO-SILK  [SMT-JUMPER_2_NO_NO-SILK]  24.38,191.25 0 top
JP24  JUMPER-SMT_2_NO_NO-SILK  [SMT-JUMPER_2_NO_NO-SILK]  39.38,191.25 0 top
JP25  JUMPER-SMT_2_NO_NO-SILK  [SMT-JUMPER_2_NO_NO-SILK]  54.38,191.25 0 top
JP26  JUMPER-SMT_2_NO_NO-SILK  [SMT-JUMPER_2_NO_NO-SILK]  69.38,191.25 0 top
JP27  JUMPER-SMT_2_NO_NO-SILK  [SMT-JUMPER_2_NO_NO-SILK]  84.38,191.25 0 top
JP28  JUMPER-SMT_2_NO_NO-SILK  [SMT-JUMPER_2_NO_NO-SILK]  99.38,191.25 0 top
JP29  JUMPER-SMT_2_NO_NO-SILK  [SMT-JUMPER_2_NO_NO-SILK]  114.38,191.25 0 top
JP30  JUMPER-SMT_2_NO_NO-SILK  [SMT-JUMPER_2_NO_NO-SILK]  129.38,191.25 0 top
JP31  JUMPER-SMT_2_NO_NO-SILK  [SMT-JUMPER_2_NO_NO-SILK]  144.38,191.25 0 top
JP32  JUMPER-SMT_2_NO_NO-SILK  [SMT-JUMPER_2_NO_NO-SILK]  159.38,191.25 0 top
JP33  JUMPER-SMT_2_NO_NO-SILK  [SMT-JUMPER_2_NO_NO-SILK]  174.38,191.25 0 top
JP34  JUMPER-SMT_2_NO_NO-SILK  [SMT-JUMPER_2_NO_NO-SILK]  189.38,191.25 0 top
JP35  JUMPER-SMT_2_NO_NO-SILK  [SMT-JUMPER_2_NO_NO-SILK]  204.38,191.25 0 top
JP36  JUMPER-SMT_2_NO_NO-SILK  [SMT-JUMPER_2_NO_NO-SILK]  219.38,191.25 0 top
JP37  JUMPER-SMT_2_NO_NO-SILK  [SMT-JUMPER_2_NO_NO-SILK]  234.38,191.25 0 top
JP38  JUMPER-SMT_2_NO_NO-SILK  [SMT-JUMPER_2_NO_NO-SILK]  249.38,191.25 0 top
JP39  JUMPER-SMT_2_NO_NO-SILK  [SMT-JUMPER_2_NO_NO-SILK]  264.38,191.25 0 top
JP40  JUMPER-SMT_2_NO_NO-SILK  [SMT-JUMPER_2_NO_NO-SILK]  279.38,191.25 0 top
JP41  JUMPER-SMT_2_NO_NO-SILK  [SMT-JUMPER_2_NO_NO-SILK]  294.38,191.25 0 top
JP42  JUMPER-SMT_2_NO_NO-SILK  [SMT-JUMPER_2_NO_NO-SILK]  309.38,191.25 0 top
JP43  JUMPER-SMT_2_NO_NO-SILK  [SMT-JUMPER_2_NO_NO-SILK]  9.38,176.25 0 top
JP44  JUMPER-SMT_2_NO_NO-SILK  [SMT-JUMPER_2_NO_NO-SILK]  24.38,176.25 0 top
JP45  JUMPER-SMT_2_NO_NO-SILK  [SMT-JUMPER_2_NO_NO-SILK]  39.38,176.25 0 top
JP46  JUMPER-SMT_2_NO_NO-SILK  [SMT-JUMPER_2_NO_NO-SILK]  54.38,176.25 0 top
JP47  JUMPER-SMT_2_NO_NO-SILK  [SMT-JUMPER_2_NO_NO-SILK]  69.38,176.25 0 top
JP48  JUMPER-SMT_2_NO_NO-SILK  [SMT-JUMPER_2_NO_NO-SILK]  84.38,176.25 0 top
JP49  JUMPER-SMT_2_NO_NO-SILK  [SMT-JUMPER_2_NO_NO-SILK]  99.38,176.25 0 top
JP50  JUMPER-SMT_2_NO_NO-SILK  [SMT-JUMPER_2_NO_NO-SILK]  114.38,176.25 0 top
JP51  JUMPER-SMT_2_NO_NO-SILK  [SMT-JUMPER_2_NO_NO-SILK]  129.38,176.25 0 top
JP52  JUMPER-SMT_2_NO_NO-SILK  [SMT-JUMPER_2_NO_NO-SILK]  144.38,176.25 0 top
JP53  JUMPER-SMT_2_NO_NO-SILK  [SMT-JUMPER_2_NO_NO-SILK]  159.38,176.25 0 top
JP54  JUMPER-SMT_2_NO_NO-SILK  [SMT-JUMPER_2_NO_NO-SILK]  174.38,176.25 0 top
JP55  JUMPER-SMT_2_NO_NO-SILK  [SMT-JUMPER_2_NO_NO-SILK]  189.38,176.25 0 top
JP56  JUMPER-SMT_2_NO_NO-SILK  [SMT-JUMPER_2_NO_NO-SILK]  204.38,176.25 0 top
JP57  JUMPER-SMT_2_NO_NO-SILK  [SMT-JUMPER_2_NO_NO-SILK]  219.38,176.25 0 top
JP58  JUMPER-SMT_2_NO_NO-SILK  [SMT-JUMPER_2_NO_NO-SILK]  234.38,176.25 0 top
JP59  JUMPER-SMT_2_NO_NO-SILK  [SMT-JUMPER_2_NO_NO-SILK]  249.38,176.25 0 top
JP60  JUMPER-SMT_2_NO_NO-SILK  [SMT-JUMPER_2_NO_NO-SILK]  264.38,176.25 0 top
JP61  JUMPER-SMT_2_NO_NO-SILK  [SMT-JUMPER_2_NO_NO-SILK]  279.38,176.25 0 top
JP62  JUMPER-SMT_2_NO_NO-SILK  [SMT-JUMPER_2_NO_NO-SILK]  294.38,176.25 0 top
JP63  JUMPER-SMT_2_NO_NO-SILK  [SMT-JUMPER_2_NO_NO-SILK]  309.38,176.25 0 top
JP64  JUMPER-SMT_2_NO_NO-SILK  [SMT-JUMPER_2_NO_NO-SILK]  9.38,161.25 0 top
JP65  JUMPER-SMT_2_NO_NO-SILK  [SMT-JUMPER_2_NO_NO-SILK]  24.38,161.25 0 top
JP66  JUMPER-SMT_2_NO_NO-SILK  [SMT-JUMPER_2_NO_NO-SILK]  39.38,161.25 0 top
JP67  JUMPER-SMT_2_NO_NO-SILK  [SMT-JUMPER_2_NO_NO-SILK]  54.38,161.25 0 top
JP68  JUMPER-SMT_2_NO_NO-SILK  [SMT-JUMPER_2_NO_NO-SILK]  69.38,161.25 0 top
JP69  JUMPER-SMT_2_NO_NO-SILK  [SMT-JUMPER_2_NO_NO-SILK]  84.38,161.25 0 top
JP70  JUMPER-SMT_2_NO_NO-SILK  [SMT-JUMPER_2_NO_NO-SILK]  99.38,161.25 0 top
JP71  JUMPER-SMT_2_NO_NO-SILK  [SMT-JUMPER_2_NO_NO-SILK]  114.38,161.25 0 top
JP72  JUMPER-SMT_2_NO_NO-SILK  [SMT-JUMPER_2_NO_NO-SILK]  129.38,161.25 0 top
JP73  JUMPER-SMT_2_NO_NO-SILK  [SMT-JUMPER_2_NO_NO-SILK]  144.38,161.25 0 top
JP74  JUMPER-SMT_2_NO_NO-SILK  [SMT-JUMPER_2_NO_NO-SILK]  159.38,161.25 0 top
JP75  JUMPER-SMT_2_NO_NO-SILK  [SMT-JUMPER_2_NO_NO-SILK]  174.38,161.25 0 top
JP76  JUMPER-SMT_2_NO_NO-SILK  [SMT-JUMPER_2_NO_NO-SILK]  189.38,161.25 0 top
JP77  JUMPER-SMT_2_NO_NO-SILK  [SMT-JUMPER_2_NO_NO-SILK]  204.38,161.25 0 top
JP78  JUMPER-SMT_2_NO_NO-SILK  [SMT-JUMPER_2_NO_NO-SILK]  219.38,161.25 0 top
JP79  JUMPER-SMT_2_NO_NO-SILK  [SMT-JUMPER_2_NO_NO-SILK]  234.38,161.25 0 top
JP80  JUMPER-SMT_2_NO_NO-SILK  [SMT-JUMPER_2_NO_NO-SILK]  249.38,161.25 0 top
JP81  JUMPER-SMT_2_NO_NO-SILK  [SMT-JUMPER_2_NO_NO-SILK]  264.38,161.25 0 top
JP82  JUMPER-SMT_2_NO_NO-SILK  [SMT-JUMPER_2_NO_NO-SILK]  279.38,161.25 0 top
JP83  JUMPER-SMT_2_NO_NO-SILK  [SMT-JUMPER_2_NO_NO-SILK]  294.38,161.25 0 top
JP84  JUMPER-SMT_2_NO_NO-SILK  [SMT-JUMPER_2_NO_NO-SILK]  339.38,161.25 0 top
JP85  JUMPER-SMT_2_NO_NO-SILK  [SMT-JUMPER_2_NO_NO-SILK]  9.38,146.25 0 top
JP86  JUMPER-SMT_2_NO_NO-SILK  [SMT-JUMPER_2_NO_NO-SILK]  24.38,146.25 0 top
JP87  JUMPER-SMT_2_NO_NO-SILK  [SMT-JUMPER_2_NO_NO-SILK]  39.38,146.25 0 top
JP88  JUMPER-SMT_2_NO_NO-SILK  [SMT-JUMPER_2_NO_NO-SILK]  54.38,146.25 0 top
JP89  JUMPER-SMT_2_NO_NO-SILK  [SMT-JUMPER_2_NO_NO-SILK]  69.38,146.25 0 top
JP90  JUMPER-SMT_2_NO_NO-SILK  [SMT-JUMPER_2_NO_NO-SILK]  84.38,146.25 0 top
JP91  JUMPER-SMT_2_NO_NO-SILK  [SMT-JUMPER_2_NO_NO-SILK]  99.38,146.25 0 top
JP92  JUMPER-SMT_2_NO_NO-SILK  [SMT-JUMPER_2_NO_NO-SILK]  114.38,146.25 0 top
JP93  JUMPER-SMT_2_NO_NO-SILK  [SMT-JUMPER_2_NO_NO-SILK]  129.38,146.25 0 top
JP94  JUMPER-SMT_2_NO_NO-SILK  [SMT-JUMPER_2_NO_NO-SILK]  144.38,146.25 0 top
JP95  JUMPER-SMT_2_NO_NO-SILK  [SMT-JUMPER_2_NO_NO-SILK]  159.38,146.25 0 top
JP96  JUMPER-SMT_2_NO_NO-SILK  [SMT-JUMPER_2_NO_NO-SILK]  174.38,146.25 0 top
JP97  JUMPER-SMT_2_NO_NO-SILK  [SMT-JUMPER_2_NO_NO-SILK]  189.38,146.25 0 top
JP98  JUMPER-SMT_2_NO_NO-SILK  [SMT-JUMPER_2_NO_NO-SILK]  204.38,146.25 0 top
JP99  JUMPER-SMT_2_NO_NO-SILK  [SMT-JUMPER_2_NO_NO-SILK]  219.38,146.25 0 top
JP100  JUMPER-SMT_2_NO_NO-SILK  [SMT-JUMPER_2_NO_NO-SILK]  234.38,146.25 0 top
JP101  JUMPER-SMT_2_NO_NO-SILK  [SMT-JUMPER_2_NO_NO-SILK]  249.38,146.25 0 top
JP102  JUMPER-SMT_2_NO_NO-SILK  [SMT-JUMPER_2_NO_NO-SILK]  264.38,146.25 0 top
JP103  JUMPER-SMT_2_NO_NO-SILK  [SMT-JUMPER_2_NO_NO-SILK]  279.38,146.25 0 top
JP104  JUMPER-SMT_2_NO_NO-SILK  [SMT-JUMPER_2_NO_NO-SILK]  294.38,146.25 0 top
JP105  JUMPER-SMT_2_NO_NO-SILK  [SMT-JUMPER_2_NO_NO-SILK]  309.38,146.25 0 top
JP106  JUMPER-SMT_2_NO_NO-SILK  [SMT-JUMPER_2_NO_NO-SILK]  9.38,131.25 0 top
JP107  JUMPER-SMT_2_NO_NO-SILK  [SMT-JUMPER_2_NO_NO-SILK]  24.38,131.25 0 top
JP108  JUMPER-SMT_2_NO_NO-SILK  [SMT-JUMPER_2_NO_NO-SILK]  39.38,131.25 0 top
JP109  JUMPER-SMT_2_NO_NO-SILK  [SMT-JUMPER_2_NO_NO-SILK]  54.38,131.25 0 top
JP110  JUMPER-SMT_2_NO_NO-SILK  [SMT-JUMPER_2_NO_NO-SILK]  69.38,131.25 0 top
JP111  JUMPER-SMT_2_NO_NO-SILK  [SMT-JUMPER_2_NO_NO-SILK]  84.38,131.25 0 top
JP112  JUMPER-SMT_2_NO_NO-SILK  [SMT-JUMPER_2_NO_NO-SILK]  99.38,131.25 0 top
JP113  JUMPER-SMT_2_NO_NO-SILK  [SMT-JUMPER_2_NO_NO-SILK]  114.38,131.25 0 top
JP114  JUMPER-SMT_2_NO_NO-SILK  [SMT-JUMPER_2_NO_NO-SILK]  129.38,131.25 0 top
JP115  JUMPER-SMT_2_NO_NO-SILK  [SMT-JUMPER_2_NO_NO-SILK]  144.38,131.25 0 top
JP116  JUMPER-SMT_2_NO_NO-SILK  [SMT-JUMPER_2_NO_NO-SILK]  159.38,131.25 0 top
JP117  JUMPER-SMT_2_NO_NO-SILK  [SMT-JUMPER_2_NO_NO-SILK]  174.38,131.25 0 top
JP118  JUMPER-SMT_2_NO_NO-SILK  [SMT-JUMPER_2_NO_NO-SILK]  189.38,131.25 0 top
JP119  JUMPER-SMT_2_NO_NO-SILK  [SMT-JUMPER_2_NO_NO-SILK]  204.38,131.25 0 top
JP120  JUMPER-SMT_2_NO_NO-SILK  [SMT-JUMPER_2_NO_NO-SILK]  219.38,131.25 0 top
JP121  JUMPER-SMT_2_NO_NO-SILK  [SMT-JUMPER_2_NO_NO-SILK]  234.38,131.25 0 top
JP122  JUMPER-SMT_2_NO_NO-SILK  [SMT-JUMPER_2_NO_NO-SILK]  249.38,131.25 0 top
JP123  JUMPER-SMT_2_NO_NO-SILK  [SMT-JUMPER_2_NO_NO-SILK]  264.38,131.25 0 top
JP124  JUMPER-SMT_2_NO_NO-SILK  [SMT-JUMPER_2_NO_NO-SILK]  279.38,131.25 0 top
JP125  JUMPER-SMT_2_NO_NO-SILK  [SMT-JUMPER_2_NO_NO-SILK]  294.38,131.25 0 top
JP126  JUMPER-SMT_2_NO_NO-SILK  [SMT-JUMPER_2_NO_NO-SILK]  309.38,131.25 0 top
JP127  JUMPER-SMT_2_NO_NO-SILK  [SMT-JUMPER_2_NO_NO-SILK]  9.38,116.25 0 top
JP128  JUMPER-SMT_2_NO_NO-SILK  [SMT-JUMPER_2_NO_NO-SILK]  24.38,116.25 0 top
JP129  JUMPER-SMT_2_NO_NO-SILK  [SMT-JUMPER_2_NO_NO-SILK]  39.38,116.25 0 top
JP130  JUMPER-SMT_2_NO_NO-SILK  [SMT-JUMPER_2_NO_NO-SILK]  54.38,116.25 0 top
JP131  JUMPER-SMT_2_NO_NO-SILK  [SMT-JUMPER_2_NO_NO-SILK]  69.38,116.25 0 top
JP132  JUMPER-SMT_2_NO_NO-SILK  [SMT-JUMPER_2_NO_NO-SILK]  84.38,116.25 0 top
JP133  JUMPER-SMT_2_NO_NO-SILK  [SMT-JUMPER_2_NO_NO-SILK]  99.38,116.25 0 top
JP134  JUMPER-SMT_2_NO_NO-SILK  [SMT-JUMPER_2_NO_NO-SILK]  114.38,116.25 0 top
JP135  JUMPER-SMT_2_NO_NO-SILK  [SMT-JUMPER_2_NO_NO-SILK]  129.38,116.25 0 top
JP136  JUMPER-SMT_2_NO_NO-SILK  [SMT-JUMPER_2_NO_NO-SILK]  144.38,116.25 0 top
JP137  JUMPER-SMT_2_NO_NO-SILK  [SMT-JUMPER_2_NO_NO-SILK]  159.38,116.25 0 top
JP138  JUMPER-SMT_2_NO_NO-SILK  [SMT-JUMPER_2_NO_NO-SILK]  174.38,116.25 0 top
JP139  JUMPER-SMT_2_NO_NO-SILK  [SMT-JUMPER_2_NO_NO-SILK]  189.38,116.25 0 top
JP140  JUMPER-SMT_2_NO_NO-SILK  [SMT-JUMPER_2_NO_NO-SILK]  204.38,116.25 0 top
JP141  JUMPER-SMT_2_NO_NO-SILK  [SMT-JUMPER_2_NO_NO-SILK]  219.38,116.25 0 top
JP142  JUMPER-SMT_2_NO_NO-SILK  [SMT-JUMPER_2_NO_NO-SILK]  234.38,116.25 0 top
JP143  JUMPER-SMT_2_NO_NO-SILK  [SMT-JUMPER_2_NO_NO-SILK]  249.38,116.25 0 top
JP144  JUMPER-SMT_2_NO_NO-SILK  [SMT-JUMPER_2_NO_NO-SILK]  264.38,116.25 0 top
JP145  JUMPER-SMT_2_NO_NO-SILK  [SMT-JUMPER_2_NO_NO-SILK]  279.38,116.25 0 top
JP146  JUMPER-SMT_2_NO_NO-SILK  [SMT-JUMPER_2_NO_NO-SILK]  294.38,116.25 0 top
JP147  JUMPER-SMT_2_NO_NO-SILK  [SMT-JUMPER_2_NO_NO-SILK]  309.38,116.25 0 top
JP148  JUMPER-SMT_2_NO_NO-SILK  [SMT-JUMPER_2_NO_NO-SILK]  9.38,101.25 0 top
JP149  JUMPER-SMT_2_NO_NO-SILK  [SMT-JUMPER_2_NO_NO-SILK]  24.38,101.25 0 top
JP150  JUMPER-SMT_2_NO_NO-SILK  [SMT-JUMPER_2_NO_NO-SILK]  39.38,101.25 0 top
JP151  JUMPER-SMT_2_NO_NO-SILK  [SMT-JUMPER_2_NO_NO-SILK]  54.38,101.25 0 top
JP152  JUMPER-SMT_2_NO_NO-SILK  [SMT-JUMPER_2_NO_NO-SILK]  69.38,101.25 0 top
JP153  JUMPER-SMT_2_NO_NO-SILK  [SMT-JUMPER_2_NO_NO-SILK]  84.38,101.25 0 top
JP154  JUMPER-SMT_2_NO_NO-SILK  [SMT-JUMPER_2_NO_NO-SILK]  99.38,101.25 0 top
JP155  JUMPER-SMT_2_NO_NO-SILK  [SMT-JUMPER_2_NO_NO-SILK]  114.38,101.25 0 top
JP156  JUMPER-SMT_2_NO_NO-SILK  [SMT-JUMPER_2_NO_NO-SILK]  129.38,101.25 0 top
JP157  JUMPER-SMT_2_NO_NO-SILK  [SMT-JUMPER_2_NO_NO-SILK]  144.38,101.25 0 top
JP158  JUMPER-SMT_2_NO_NO-SILK  [SMT-JUMPER_2_NO_NO-SILK]  159.38,101.25 0 top
JP159  JUMPER-SMT_2_NO_NO-SILK  [SMT-JUMPER_2_NO_NO-SILK]  174.38,101.25 0 top
JP160  JUMPER-SMT_2_NO_NO-SILK  [SMT-JUMPER_2_NO_NO-SILK]  189.38,101.25 0 top
JP161  JUMPER-SMT_2_NO_NO-SILK  [SMT-JUMPER_2_NO_NO-SILK]  234.38,101.25 0 top
JP162  JUMPER-SMT_2_NO_NO-SILK  [SMT-JUMPER_2_NO_NO-SILK]  249.38,101.25 0 top
JP163  JUMPER-SMT_2_NO_NO-SILK  [SMT-JUMPER_2_NO_NO-SILK]  264.38,101.25 0 top
JP164  JUMPER-SMT_2_NO_NO-SILK  [SMT-JUMPER_2_NO_NO-SILK]  279.38,101.25 0 top
JP165  JUMPER-SMT_2_NO_NO-SILK  [SMT-JUMPER_2_NO_NO-SILK]  294.38,101.25 0 top
JP166  JUMPER-SMT_2_NO_NO-SILK  [SMT-JUMPER_2_NO_NO-SILK]  309.38,101.25 0 top
JP167  JUMPER-SMT_2_NO_NO-SILK  [SMT-JUMPER_2_NO_NO-SILK]  324.38,101.25 0 top
JP168  JUMPER-SMT_2_NO_NO-SILK  [SMT-JUMPER_2_NO_NO-SILK]  339.38,101.25 0 top
JP169  JUMPER-SMT_2_NO_NO-SILK  [SMT-JUMPER_2_NO_NO-SILK]  9.38,86.25 0 top
JP170  JUMPER-SMT_2_NO_NO-SILK  [SMT-JUMPER_2_NO_NO-SILK]  24.38,86.25 0 top
JP171  JUMPER-SMT_2_NO_NO-SILK  [SMT-JUMPER_2_NO_NO-SILK]  39.38,86.25 0 top
JP172  JUMPER-SMT_2_NO_NO-SILK  [SMT-JUMPER_2_NO_NO-SILK]  54.38,86.25 0 top
JP173  JUMPER-SMT_2_NO_NO-SILK  [SMT-JUMPER_2_NO_NO-SILK]  69.38,86.25 0 top
JP174  JUMPER-SMT_2_NO_NO-SILK  [SMT-JUMPER_2_NO_NO-SILK]  84.38,86.25 0 top
JP175  JUMPER-SMT_2_NO_NO-SILK  [SMT-JUMPER_2_NO_NO-SILK]  99.38,86.25 0 top
JP176  JUMPER-SMT_2_NO_NO-SILK  [SMT-JUMPER_2_NO_NO-SILK]  114.38,86.25 0 top
JP177  JUMPER-SMT_2_NO_NO-SILK  [SMT-JUMPER_2_NO_NO-SILK]  129.38,86.25 0 top
JP178  JUMPER-SMT_2_NO_NO-SILK  [SMT-JUMPER_2_NO_NO-SILK]  144.38,86.25 0 top
JP179  JUMPER-SMT_2_NO_NO-SILK  [SMT-JUMPER_2_NO_NO-SILK]  159.38,86.25 0 top
JP180  JUMPER-SMT_2_NO_NO-SILK  [SMT-JUMPER_2_NO_NO-SILK]  174.38,86.25 0 top
JP181  JUMPER-SMT_2_NO_NO-SILK  [SMT-JUMPER_2_NO_NO-SILK]  189.38,86.25 0 top
JP182  JUMPER-SMT_2_NO_NO-SILK  [SMT-JUMPER_2_NO_NO-SILK]  204.38,86.25 0 top
JP183  JUMPER-SMT_2_NO_NO-SILK  [SMT-JUMPER_2_NO_NO-SILK]  219.38,86.25 0 top
JP184  JUMPER-SMT_2_NO_NO-SILK  [SMT-JUMPER_2_NO_NO-SILK]  234.38,86.25 0 top
JP185  JUMPER-SMT_2_NO_NO-SILK  [SMT-JUMPER_2_NO_NO-SILK]  249.38,86.25 0 top
JP186  JUMPER-SMT_2_NO_NO-SILK  [SMT-JUMPER_2_NO_NO-SILK]  264.38,86.25 0 top
JP187  JUMPER-SMT_2_NO_NO-SILK  [SMT-JUMPER_2_NO_NO-SILK]  309.38,86.25 0 top
JP188  JUMPER-SMT_2_NO_NO-SILK  [SMT-JUMPER_2_NO_NO-SILK]  324.38,86.25 0 top
JP189  JUMPER-SMT_2_NO_NO-SILK  [SMT-JUMPER_2_NO_NO-SILK]  339.38,86.25 0 top
JP190  JUMPER-SMT_2_NO_NO-SILK  [SMT-JUMPER_2_NO_NO-SILK]  9.38,71.25 0 top
JP191  JUMPER-SMT_2_NO_NO-SILK  [SMT-JUMPER_2_NO_NO-SILK]  24.38,71.25 0 top
JP192  JUMPER-SMT_2_NO_NO-SILK  [SMT-JUMPER_2_NO_NO-SILK]  39.38,71.25 0 top
JP193  JUMPER-SMT_2_NO_NO-SILK  [SMT-JUMPER_2_NO_NO-SILK]  54.38,71.25 0 top
JP194  JUMPER-SMT_2_NO_NO-SILK  [SMT-JUMPER_2_NO_NO-SILK]  69.38,71.25 0 top
JP195  JUMPER-SMT_2_NO_NO-SILK  [SMT-JUMPER_2_NO_NO-SILK]  84.38,71.25 0 top
JP196  JUMPER-SMT_2_NO_NO-SILK  [SMT-JUMPER_2_NO_NO-SILK]  99.38,71.25 0 top
JP197  JUMPER-SMT_2_NO_NO-SILK  [SMT-JUMPER_2_NO_NO-SILK]  114.38,71.25 0 top
JP198  JUMPER-SMT_2_NO_NO-SILK  [SMT-JUMPER_2_NO_NO-SILK]  129.38,71.25 0 top
JP199  JUMPER-SMT_2_NO_NO-SILK  [SMT-JUMPER_2_NO_NO-SILK]  144.38,71.25 0 top
JP200  JUMPER-SMT_2_NO_NO-SILK  [SMT-JUMPER_2_NO_NO-SILK]  159.38,71.25 0 top
JP201  JUMPER-SMT_2_NO_NO-SILK  [SMT-JUMPER_2_NO_NO-SILK]  174.38,71.25 0 top
JP202  JUMPER-SMT_2_NO_NO-SILK  [SMT-JUMPER_2_NO_NO-SILK]  189.38,71.25 0 top
JP203  JUMPER-SMT_2_NO_NO-SILK  [SMT-JUMPER_2_NO_NO-SILK]  204.38,71.25 0 top
JP204  JUMPER-SMT_2_NO_NO-SILK  [SMT-JUMPER_2_NO_NO-SILK]  219.38,71.25 0 top
JP205  JUMPER-SMT_2_NO_NO-SILK  [SMT-JUMPER_2_NO_NO-SILK]  234.38,71.25 0 top
JP206  JUMPER-SMT_2_NO_NO-SILK  [SMT-JUMPER_2_NO_NO-SILK]  249.38,71.25 0 top
JP207  JUMPER-SMT_2_NO_NO-SILK  [SMT-JUMPER_2_NO_NO-SILK]  294.38,71.25 0 top
JP208  JUMPER-SMT_2_NO_NO-SILK  [SMT-JUMPER_2_NO_NO-SILK]  309.38,71.25 0 top
JP209  JUMPER-SMT_2_NO_NO-SILK  [SMT-JUMPER_2_NO_NO-SILK]  324.38,71.25 0 top
JP210  JUMPER-SMT_2_NO_NO-SILK  [SMT-JUMPER_2_NO_NO-SILK]  339.38,71.25 0 top
JP211  JUMPER-SMT_2_NO_NO-SILK  [SMT-JUMPER_2_NO_NO-SILK]  324.38,206.25 0 top
JP212  JUMPER-SMT_2_NO_NO-SILK  [SMT-JUMPER_2_NO_NO-SILK]  24.38,41.25 0 top
JP213  JUMPER-SMT_2_NO_NO-SILK  [SMT-JUMPER_2_NO_NO-SILK]  39.38,41.25 0 top
JP214  JUMPER-SMT_2_NO_NO-SILK  [SMT-JUMPER_2_NO_NO-SILK]  54.38,41.25 0 top
JP215  JUMPER-SMT_2_NO_NO-SILK  [SMT-JUMPER_2_NO_NO-SILK]  69.38,41.25 0 top
JP216  JUMPER-SMT_2_NO_NO-SILK  [SMT-JUMPER_2_NO_NO-SILK]  84.38,41.25 0 top
JP217  JUMPER-SMT_2_NO_NO-SILK  [SMT-JUMPER_2_NO_NO-SILK]  99.38,41.25 0 top
JP218  JUMPER-SMT_2_NO_NO-SILK  [SMT-JUMPER_2_NO_NO-SILK]  114.38,41.25 0 top
JP219  JUMPER-SMT_2_NO_NO-SILK  [SMT-JUMPER_2_NO_NO-SILK]  129.38,41.25 0 top
JP220  JUMPER-SMT_2_NO_NO-SILK  [SMT-JUMPER_2_NO_NO-SILK]  144.38,41.25 0 top
JP221  JUMPER-SMT_2_NO_NO-SILK  [SMT-JUMPER_2_NO_NO-SILK]  159.38,41.25 0 top
JP222  JUMPER-SMT_2_NO_NO-SILK  [SMT-JUMPER_2_NO_NO-SILK]  174.38,41.25 0 top
JP223  JUMPER-SMT_2_NO_NO-SILK  [SMT-JUMPER_2_NO_NO-SILK]  189.38,41.25 0 top
JP224  JUMPER-SMT_2_NO_NO-SILK  [SMT-JUMPER_2_NO_NO-SILK]  204.38,41.25 0 top
JP225  JUMPER-SMT_2_NO_NO-SILK  [SMT-JUMPER_2_NO_NO-SILK]  219.38,41.25 0 top
JP226  JUMPER-SMT_2_NO_NO-SILK  [SMT-JUMPER_2_NO_NO-SILK]  234.38,41.25 0 top
JP227  JUMPER-SMT_2_NO_NO-SILK  [SMT-JUMPER_2_NO_NO-SILK]  249.38,41.25 0 top
JP228  JUMPER-SMT_2_NO_NO-SILK  [SMT-JUMPER_2_NO_NO-SILK]  264.38,41.25 0 top
JP229  JUMPER-SMT_2_NO_NO-SILK  [SMT-JUMPER_2_NO_NO-SILK]  279.38,41.25 0 top
JP230  JUMPER-SMT_2_NO_NO-SILK  [SMT-JUMPER_2_NO_NO-SILK]  324.38,41.25 0 top
JP231  JUMPER-SMT_2_NO_NO-SILK  [SMT-JUMPER_2_NO_NO-SILK]  339.38,41.25 0 top
JP232  JUMPER-SMT_2_NO_NO-SILK  [SMT-JUMPER_2_NO_NO-SILK]  84.38,26.25 0 top
JP233  JUMPER-SMT_2_NO_NO-SILK  [SMT-JUMPER_2_NO_NO-SILK]  99.38,26.25 0 top
JP234  JUMPER-SMT_2_NO_NO-SILK  [SMT-JUMPER_2_NO_NO-SILK]  114.38,26.25 0 top
JP235  JUMPER-SMT_2_NO_NO-SILK  [SMT-JUMPER_2_NO_NO-SILK]  129.38,26.25 0 top
JP236  JUMPER-SMT_2_NO_NO-SILK  [SMT-JUMPER_2_NO_NO-SILK]  144.38,26.25 0 top
JP237  JUMPER-SMT_2_NO_NO-SILK  [SMT-JUMPER_2_NO_NO-SILK]  159.38,26.25 0 top
JP238  JUMPER-SMT_2_NO_NO-SILK  [SMT-JUMPER_2_NO_NO-SILK]  174.38,26.25 0 top
JP239  JUMPER-SMT_2_NO_NO-SILK  [SMT-JUMPER_2_NO_NO-SILK]  189.38,26.25 0 top
JP240  JUMPER-SMT_2_NO_NO-SILK  [SMT-JUMPER_2_NO_NO-SILK]  204.38,26.25 0 top
JP241  JUMPER-SMT_2_NO_NO-SILK  [SMT-JUMPER_2_NO_NO-SILK]  219.38,26.25 0 top
JP242  JUMPER-SMT_2_NO_NO-SILK  [SMT-JUMPER_2_NO_NO-SILK]  234.38,26.25 0 top
JP243  JUMPER-SMT_2_NO_NO-SILK  [SMT-JUMPER_2_NO_NO-SILK]  249.38,26.25 0 top
JP244  JUMPER-SMT_2_NO_NO-SILK  [SMT-JUMPER_2_NO_NO-SILK]  264.38,26.25 0 top
JP245  JUMPER-SMT_2_NO_NO-SILK  [SMT-JUMPER_2_NO_NO-SILK]  309.38,26.25 0 top
JP246  JUMPER-SMT_2_NO_NO-SILK  [SMT-JUMPER_2_NO_NO-SILK]  324.38,26.25 0 top
JP247  JUMPER-SMT_2_NO_NO-SILK  [SMT-JUMPER_2_NO_NO-SILK]  339.38,26.25 0 top
JP248  JUMPER-SMT_2_NO_NO-SILK  [SMT-JUMPER_2_NO_NO-SILK]  9.38,41.25 0 top
JP249  JUMPER-SMT_2_NO_NO-SILK  [SMT-JUMPER_2_NO_NO-SILK]  5,152.5 270 top
JP250  JUMPER-SMT_2_NO_NO-SILK  [SMT-JUMPER_2_NO_NO-SILK]  69.38,11.25 0 top
JP251  JUMPER-SMT_2_NO_NO-SILK  [SMT-JUMPER_2_NO_NO-SILK]  84.38,11.25 0 top
JP252  JUMPER-SMT_2_NO_NO-SILK  [SMT-JUMPER_2_NO_NO-SILK]  99.38,11.25 0 top
JP253  JUMPER-SMT_2_NO_NO-SILK  [SMT-JUMPER_2_NO_NO-SILK]  114.38,11.25 0 top
JP254  JUMPER-SMT_2_NO_NO-SILK  [SMT-JUMPER_2_NO_NO-SILK]  129.38,11.25 0 top
JP255  JUMPER-SMT_2_NO_NO-SILK  [SMT-JUMPER_2_NO_NO-SILK]  145.62,11.25 0 top
JP256  JUMPER-SMT_2_NO_NO-SILK  [SMT-JUMPER_2_NO_NO-SILK]  204.38,11.25 0 top
JP257  JUMPER-SMT_2_NO_NO-SILK  [SMT-JUMPER_2_NO_NO-SILK]  219.38,11.25 0 top
JP258  JUMPER-SMT_2_NO_NO-SILK  [SMT-JUMPER_2_NO_NO-SILK]  234.38,11.25 0 top
JP259  JUMPER-SMT_2_NO_NO-SILK  [SMT-JUMPER_2_NO_NO-SILK]  249.38,11.25 0 top
JP260  JUMPER-SMT_2_NO_NO-SILK  [SMT-JUMPER_2_NO_NO-SILK]  309.38,11.25 0 top
JP261  JUMPER-SMT_2_NO_NO-SILK  [SMT-JUMPER_2_NO_NO-SILK]  324.38,11.25 0 top
JP262  JUMPER-SMT_2_NO_NO-SILK  [SMT-JUMPER_2_NO_NO-SILK]  24.38,56.25 0 top
JP263  JUMPER-SMT_2_NO_NO-SILK  [SMT-JUMPER_2_NO_NO-SILK]  324.38,191.25 0 top
JP264  JUMPER-SMT_2_NO_NO-SILK  [SMT-JUMPER_2_NO_NO-SILK]  339.38,191.25 0 top
JP265  JUMPER-SMT_2_NO_NO-SILK  [SMT-JUMPER_2_NO_NO-SILK]  324.38,176.25 0 top
JP266  JUMPER-SMT_2_NO_NO-SILK  [SMT-JUMPER_2_NO_NO-SILK]  339.38,176.25 0 top
JP267  JUMPER-SMT_2_NO_NO-SILK  [SMT-JUMPER_2_NO_NO-SILK]  309.38,161.25 0 top
JP268  JUMPER-SMT_2_NO_NO-SILK  [SMT-JUMPER_2_NO_NO-SILK]  324.38,161.25 0 top
JP269  JUMPER-SMT_2_NO_NO-SILK  [SMT-JUMPER_2_NO_NO-SILK]  324.38,146.25 0 top
JP270  JUMPER-SMT_2_NO_NO-SILK  [SMT-JUMPER_2_NO_NO-SILK]  339.38,146.25 0 top
JP271  JUMPER-SMT_2_NO_NO-SILK  [SMT-JUMPER_2_NO_NO-SILK]  324.38,131.25 0 top
JP272  JUMPER-SMT_2_NO_NO-SILK  [SMT-JUMPER_2_NO_NO-SILK]  339.38,131.25 0 top
JP273  JUMPER-SMT_2_NO_NO-SILK  [SMT-JUMPER_2_NO_NO-SILK]  324.38,116.25 0 top
JP274  JUMPER-SMT_2_NO_NO-SILK  [SMT-JUMPER_2_NO_NO-SILK]  339.38,116.25 0 top
JP275  JUMPER-SMT_2_NO_NO-SILK  [SMT-JUMPER_2_NO_NO-SILK]  204.38,101.25 0 top
JP276  JUMPER-SMT_2_NO_NO-SILK  [SMT-JUMPER_2_NO_NO-SILK]  219.38,101.25 0 top
JP277  JUMPER-SMT_2_NO_NO-SILK  [SMT-JUMPER_2_NO_NO-SILK]  279.38,86.25 0 top
JP278  JUMPER-SMT_2_NO_NO-SILK  [SMT-JUMPER_2_NO_NO-SILK]  294.38,86.25 0 top
JP279  JUMPER-SMT_2_NO_NO-SILK  [SMT-JUMPER_2_NO_NO-SILK]  264.38,71.25 0 top
JP280  JUMPER-SMT_2_NO_NO-SILK  [SMT-JUMPER_2_NO_NO-SILK]  279.38,71.25 0 top
JP281  JUMPER-SMT_2_NO_NO-SILK  [SMT-JUMPER_2_NO_NO-SILK]  294.38,41.25 0 top
JP282  JUMPER-SMT_2_NO_NO-SILK  [SMT-JUMPER_2_NO_NO-SILK]  309.38,41.25 0 top
JP283  JUMPER-SMT_2_NO_NO-SILK  [SMT-JUMPER_2_NO_NO-SILK]  279.38,26.25 0 top
JP284  JUMPER-SMT_2_NO_NO-SILK  [SMT-JUMPER_2_NO_NO-SILK]  294.38,26.25 0 top
JP285  JUMPER-SMT_2_NO_NO-SILK  [SMT-JUMPER_2_NO_NO-SILK]  264.38,11.25 0 top
JP286  JUMPER-SMT_2_NO_NO-SILK  [SMT-JUMPER_2_NO_NO-SILK]  279.38,11.25 0 top
JP287  JUMPER-SMT_2_NO_NO-SILK  [SMT-JUMPER_2_NO_NO-SILK]  39.38,56.25 0 top
JP288  JUMPER-SMT_2_NO_NO-SILK  [SMT-JUMPER_2_NO_NO-SILK]  294.38,11.25 0 top
JP289  JUMPER-SMT_2_NO_NO-SILK  [SMT-JUMPER_2_NO_NO-SILK]  54.38,56.25 0 top
JP290  JUMPER-SMT_2_NO_NO-SILK  [SMT-JUMPER_2_NO_NO-SILK]  69.38,56.25 0 top
JP291  JUMPER-SMT_2_NO_NO-SILK  [SMT-JUMPER_2_NO_NO-SILK]  84.38,56.25 0 top
JP292  JUMPER-SMT_2_NO_NO-SILK  [SMT-JUMPER_2_NO_NO-SILK]  99.38,56.25 0 top
JP293  JUMPER-SMT_2_NO_NO-SILK  [SMT-JUMPER_2_NO_NO-SILK]  114.38,56.25 0 top
JP294  JUMPER-SMT_2_NO_NO-SILK  [SMT-JUMPER_2_NO_NO-SILK]  129.38,56.25 0 top
JP295  JUMPER-SMT_2_NO_NO-SILK  [SMT-JUMPER_2_NO_NO-SILK]  159.38,56.25 0 top
JP296  JUMPER-SMT_2_NO_NO-SILK  [SMT-JUMPER_2_NO_NO-SILK]  174.38,56.25 0 top
JP297  JUMPER-SMT_2_NO_NO-SILK  [SMT-JUMPER_2_NO_NO-SILK]  189.38,56.25 0 top
JP298  JUMPER-SMT_2_NO_NO-SILK  [SMT-JUMPER_2_NO_NO-SILK]  204.38,56.25 0 top
JP299  JUMPER-SMT_2_NO_NO-SILK  [SMT-JUMPER_2_NO_NO-SILK]  144.13,56.25 0 top
JP300  JUMPER-SMT_2_NO_NO-SILK  [SMT-JUMPER_2_NO_NO-SILK]  219.38,56.25 0 top
JP301  JUMPER-SMT_2_NO_NO-SILK  [SMT-JUMPER_2_NO_NO-SILK]  234.38,56.25 0 top
JP302  JUMPER-SMT_2_NO_NO-SILK  [SMT-JUMPER_2_NO_NO-SILK]  249.38,56.25 0 top
JP303  JUMPER-SMT_2_NO_NO-SILK  [SMT-JUMPER_2_NO_NO-SILK]  264.38,56.25 0 top
JP304  JUMPER-SMT_2_NO_NO-SILK  [SMT-JUMPER_2_NO_NO-SILK]  279.38,56.25 0 top
JP305  JUMPER-SMT_2_NO_NO-SILK  [SMT-JUMPER_2_NO_NO-SILK]  294.38,56.25 0 top
JP306  JUMPER-SMT_2_NO_NO-SILK  [SMT-JUMPER_2_NO_NO-SILK]  309.38,56.25 0 top
JP307  JUMPER-SMT_2_NO_NO-SILK  [SMT-JUMPER_2_NO_NO-SILK]  324.38,56.25 0 top
JP308  JUMPER-SMT_2_NO_NO-SILK  [SMT-JUMPER_2_NO_NO-SILK]  339.38,56.25 0 top
JP312  JUMPER-SMT_2_NO_NO-SILK  [SMT-JUMPER_2_NO_NO-SILK]  5,137.5 270 top
JP313  JUMPER-SMT_2_NO_NO-SILK  [SMT-JUMPER_2_NO_NO-SILK]  5,122.5 270 top
JP314  JUMPER-SMT_2_NO_NO-SILK  [SMT-JUMPER_2_NO_NO-SILK]  5,107.5 270 top
JP315  JUMPER-SMT_2_NO_NO-SILK  [SMT-JUMPER_2_NO_NO-SILK]  69.38,26.25 0 top
JP316  JUMPER-SMT_2_NO_NO-SILK  [SMT-JUMPER_2_NO_NO-SILK]  5,92.5 270 top
JP317  JUMPER-SMT_2_NO_NO-SILK  [SMT-JUMPER_2_NO_NO-SILK]  5,77.5 270 top
JP318  JUMPER-SMT_2_NO_NO-SILK  [SMT-JUMPER_2_NO_NO-SILK]  5,62.5 270 top
JP319  JUMPER-SMT_2_NO_NO-SILK  [SMT-JUMPER_2_NO_NO-SILK]  5,47.5 270 top
JP320  JUMPER-SMT_2_NO_NO-SILK  [SMT-JUMPER_2_NO_NO-SILK]  5,32.5 270 top
JP321  JUMPER-SMT_2_NO_NO-SILK  [SMT-JUMPER_2_NO_NO-SILK]  65,17.5 270 top
Q2  MBT3904DW1T1  [SC70-6]  23.48,8.45 180 top
R1  1k  [0603]  15.51,5.79 0 top
R2  10k  [0603]  20.94,8.45 270 top
R3  5.1k  [0603]  350,30.5 0 top
R4  5.1k  [0603]  350,27.5 0 top
R5  100k  [0603]  351.44,38.59 270 top
R6  100k  [0603]  345.72,38.59 270 top
R7  100k  [0603]  349.53,38.59 90 top
R8  100k  [0603]  11.45,15.25 180 top
R9  10k  [0603]  27.5,21.7 270 top
R10  10k  [0603]  24.52,21.67 90 top
R11  100k  [0603]  19,17.5 0 top
R12  100k  [0603]  355.25,38.59 270 top
R13  2.2k  [0603]  19,16 180 top
R14  1k  [0603]  347.62,41.13 0 top
R15  1k  [0603]  353.16,41.37 180 top
R16  100  [0603]  13.78,8 0 top
R17  10k  [0603]  23.48,5.91 0 top
R18  10k  [0603]  23.48,10.98 0 top
S1  RESET  [TACTILE_SWITCH_SMD_4.6X2.8MM]  28.56,10.35 180 top
S2  0  [TACTILE_SWITCH_SMD_4.6X2.8MM]  28.56,6.54 0 top
U2  ESP-WROOM-32NARROW  [ESP-WROOM-32-NARROW]  43.8,14.16 0 top
U3  AP2112K-3.3V  [SOT23-5]  11.67,19.08 0 top
U4  CP2102N  [QFN24]  17.13,10.35 0 top
U5  ADMP401  [ADMP401]  23.63,14 0 top
U$1  [UNNAMED#PNG]  175.25,108.75 0 bottom
U$2  OPA344  [SOT23-5]  19.03,21.67 90 top
U$3  [CEC7B2_1EE547F747C2467BB1A21A2065860725_MV2#JPG]  53.62,31.25 0 top

## Tracks (layer width: path | path; a pad name or v marks a point on that pad's centre or on a via)
0
  Top 0.203: U2.25 32.99,5.92 31.57,7.34 S2.3 S2.4 25.66,8.19 24.62,8.19 24.13,7.7 Q2.6
3.3V  (via drill 0.38)
  Top 0.178: C9.1 15.96,20.72
  Top 0.203: U4.5 14.1,9.6 13.78,9.28 13.78,9.04 | U4.6 13.85,9.1 13.78,9.04 | R1.1 14.66,6.09 13.95,6.8 13.75,6.8 | v13.08,6.8 13.75,6.8 | R7.2 350.5,39.44 | 350.5,39.44 R5.1 | 15.96,20.72 16.75,20.72 | 16.75,20.72 U$2.5 | 13.75,6.8 13.78,6.83 13.78,9.04 | v325.5,1 63,1 61.5,2.5 61.5,23 60.6,23.9 49.45,23.9 48.96,23.41 U2.2 48.96,19.04 v49,19 | 10.72,21.5 11.2,21.5 v11.7,21 | v16.75,19.6 16.75,20.72 | 26.5,16.6 26.5,12.5 26.05,12.05 23.85,12.05 23.5,11.7 23.5,10.41 23.3,10.21 20.21,10.21 20,10 20,8.5 19.67,8.17 v19.67,7.81 19.89,7.59 R2.2 | 26.5,16.6 v26.5,18.5 27.5,19.5 R9.2 | U5.5 26.48,16.62 26.5,16.6 | U3.5 10.72,21.5 | 10.72,21.5 9.2,21.5 | 9.2,21.5 8.2,21.5 7.45,20.75 C7.1 | C1.1 9.2,21.5 | v350.5,36.5 350.5,39.44
  Bottom 0.203: v19.67,7.81 19.67,6.54 18.4,5.27 13.32,5.27 13.08,5.51 v13.08,6.8 | v11.7,21 15.35,21 v16.75,19.6 17.85,18.5 v26.5,18.5 30.5,14.5 47,14.5 49,16.5 v49,19 | v325.5,1 329,1 344.6,16.6 344.6,30.6 v350.5,36.5
CHIP_PU  (via drill 0.38)
  Top 0.203: S1.4 28.56,9.55 | 28.56,9.55 S1.3 25.53,8.57 22.84,8.57 | R2.1 21.61,9.29 22.34,8.57 22.84,8.57 | Q2.3 22.83,8.59 22.84,8.57 | 28.56,9.55 28.56,11.62 30.83,13.89 v30.83,17.96 | v47.74,21.03 47.69,21.03 U2.3
  Bottom 0.203: v30.83,17.96 44.66,17.96 v47.74,21.03
D+  (via drill 0.38)
  Top 0.203: 352.41,28.69 353,28.69 353.05,28.75 J2.A6 | 352.41,28.69 347.94,28.69 344.19,32.44 15.64,32.44 14.1,30.9 14.1,10.85 14.35,10.6 U4.3 | v352.66,29.95 353.01,29.95 353.2,29.75 J2.B6 | v352.41,28.2 352.41,28.69
  Bottom 0.203: v352.66,29.95 352.41,29.7 v352.41,28.2
D-
  Top 0.203: U4.4 13.98,10.1 13.62,10.46 13.62,31.17 15.39,32.94 344.24,32.94 347.93,29.25 J2.A7 354.97,29.25 355.28,28.94 355.28,28.43 355.1,28.25 J2.B7
DIO0  (via drill 0.38)
  Top 0.55: v0.75,40 0.75,202.1 3.3,204.65 5,204.65 | JP2.1 23.4,206.25 D2.4 5,204.65 | v35,25 U2.13 | JP11.1 5,204.65
  Bottom 0.55: v0.75,40 0.75,28 4,24.75 31.38,24.75 31.62,25 v35,25
DIO1
  Top 0.55: JP99.2 220.35,146.25 D99.2 225.28,147.85 228.47,144.65 D100.4 233.4,146.25 JP100.1
DIO2
  Top 0.55: JP198.2 130.35,71.25 D198.2 135.28,72.85 138.47,69.65 D199.4 143.4,71.25 JP199.1
DIO3
  Top 0.55: JP6.2 85.35,206.25 D6.2 90.28,207.85 93.47,204.65 D7.4 98.4,206.25 JP7.1
DIO4
  Top 0.55: JP8.2 115.35,206.25 D8.2 120.28,207.85 123.47,204.65 D9.4 128.4,206.25 JP9.1
DIO7
  Top 0.55: JP15.2 220.35,206.25 D15.2 225.28,207.85 228.47,204.65 D16.4 233.4,206.25 JP16.1
DIO8
  Top 0.55: JP17.2 250.35,206.25 D17.2 255.28,207.85 258.48,204.65 D18.4 263.4,206.25 JP18.1
DIO9
  Top 0.55: JP19.2 280.35,206.25 D19.2 285.27,207.85 288.48,204.65 D20.4 293.4,206.25 JP20.1
DIO11
  Top 0.55: JP22.2 10.35,191.25 D22.2 15.28,192.85 18.48,189.65 D23.4 23.4,191.25 JP23.1
DIO12
  Top 0.55: JP24.2 40.35,191.25 D24.2 45.27,192.85 48.48,189.65 D25.4 53.4,191.25 JP25.1
DIO13
  Top 0.55: JP26.2 70.35,191.25 D26.2 75.28,192.85 78.47,189.65 D27.4 83.4,191.25 JP27.1
DIO14
  Top 0.55: JP28.2 100.35,191.25 D28.2 105.28,192.85 108.47,189.65 D29.4 113.4,191.25 JP29.1
DIO15
  Top 0.55: JP30.2 130.35,191.25 D30.2 135.28,192.85 138.47,189.65 D31.4 143.4,191.25 JP31.1
DIO16
  Top 0.55: JP32.2 160.35,191.25 D32.2 165.28,192.85 168.47,189.65 D33.4 173.4,191.25 JP33.1
DIO17
  Top 0.55: JP33.2 175.35,191.25 D33.2 180.28,192.85 183.47,189.65 D34.4 188.4,191.25 JP34.1
DIO18
  Top 0.55: JP35.2 205.35,191.25 D35.2 210.28,192.85 213.47,189.65 D36.4 218.4,191.25 JP36.1
DIO19
  Top 0.55: JP37.2 235.35,191.25 D37.2 240.28,192.85 243.47,189.65 D38.4 248.4,191.25 JP38.1
DIO20
  Top 0.55: JP39.2 265.35,191.25 D39.2 270.27,192.85 273.48,189.65 D40.4 278.4,191.25 JP40.1
DIO21
  Top 0.55: JP41.2 295.35,191.25 D41.2 300.27,192.85 303.48,189.65 D42.4 308.4,191.25 JP42.1
DIO22
  Top 0.55: JP43.2 10.35,176.25 D43.2 15.28,177.85 18.48,174.65 D44.4 23.4,176.25 JP44.1
DIO23
  Top 0.55: JP44.2 25.35,176.25 D44.2 30.27,177.85 33.48,174.65 D45.4 38.4,176.25 JP45.1
DIO24
  Top 0.55: JP46.2 55.35,176.25 D46.2 60.27,177.85 63.48,174.65 D47.4 68.4,176.25 JP47.1
DIO25
  Top 0.55: JP48.2 85.35,176.25 D48.2 90.28,177.85 93.47,174.65 D49.4 98.4,176.25 JP49.1
DIO26
  Top 0.55: JP50.2 115.35,176.25 D50.2 120.28,177.85 123.47,174.65 D51.4 128.4,176.25 JP51.1
DIO27
  Top 0.55: JP52.2 145.35,176.25 D52.2 150.28,177.85 153.47,174.65 D53.4 158.4,176.25 JP53.1
DIO28
  Top 0.55: JP54.2 175.35,176.25 D54.2 180.28,177.85 183.47,174.65 D55.4 188.4,176.25 JP55.1
DIO29
  Top 0.55: JP55.2 190.35,176.25 D55.2 195.28,177.85 198.47,174.65 D56.4 203.4,176.25 JP56.1
DIO30
  Top 0.55: JP57.2 220.35,176.25 D57.2 225.28,177.85 228.47,174.65 D58.4 233.4,176.25 JP58.1
DIO31
  Top 0.55: JP59.2 250.35,176.25 D59.2 255.28,177.85 258.48,174.65 D60.4 263.4,176.25 JP60.1
DIO32
  Top 0.55: JP61.2 280.35,176.25 D61.2 285.27,177.85 288.48,174.65 D62.4 293.4,176.25 JP62.1
DIO33
  Top 0.55: JP268.1 323.4,161.25 D268.4 318.48,159.65 315.27,162.85 D267.2 310.35,161.25 JP267.2
DIO34
  Top 0.55: JP65.2 25.35,161.25 D65.2 30.27,162.85 33.48,159.65 D66.4 38.4,161.25 JP66.1
DIO35
  Top 0.55: JP66.2 40.35,161.25 D66.2 45.27,162.85 48.48,159.65 D67.4 53.4,161.25 JP67.1
DIO36
  Top 0.55: JP68.2 70.35,161.25 D68.2 75.28,162.85 78.47,159.65 D69.4 83.4,161.25 JP69.1
DIO37
  Top 0.55: JP70.2 100.35,161.25 D70.2 105.28,162.85 108.47,159.65 D71.4 113.4,161.25 JP71.1
DIO38
  Top 0.55: JP72.2 130.35,161.25 D72.2 135.28,162.85 138.47,159.65 D73.4 143.4,161.25 JP73.1
DIO39
  Top 0.55: JP74.2 160.35,161.25 D74.2 165.28,162.85 168.47,159.65 D75.4 173.4,161.25 JP75.1
DIO40
  Top 0.55: JP76.2 190.35,161.25 D76.2 195.28,162.85 198.47,159.65 D77.4 203.4,161.25 JP77.1
DIO41
  Top 0.55: JP77.2 205.35,161.25 D77.2 210.28,162.85 213.47,159.65 D78.4 218.4,161.25 JP78.1
DIO42
  Top 0.55: JP79.2 235.35,161.25 D79.2 240.28,162.85 243.47,159.65 D80.4 248.4,161.25 JP80.1
DIO43